# EasyEDA schematic schematic.json
TITLE: Sheet_1; REV: 3.1; Date: 2021-11-14; Sheet: 1/1; Drawn By: hktkzyx; Company: hktkzyx
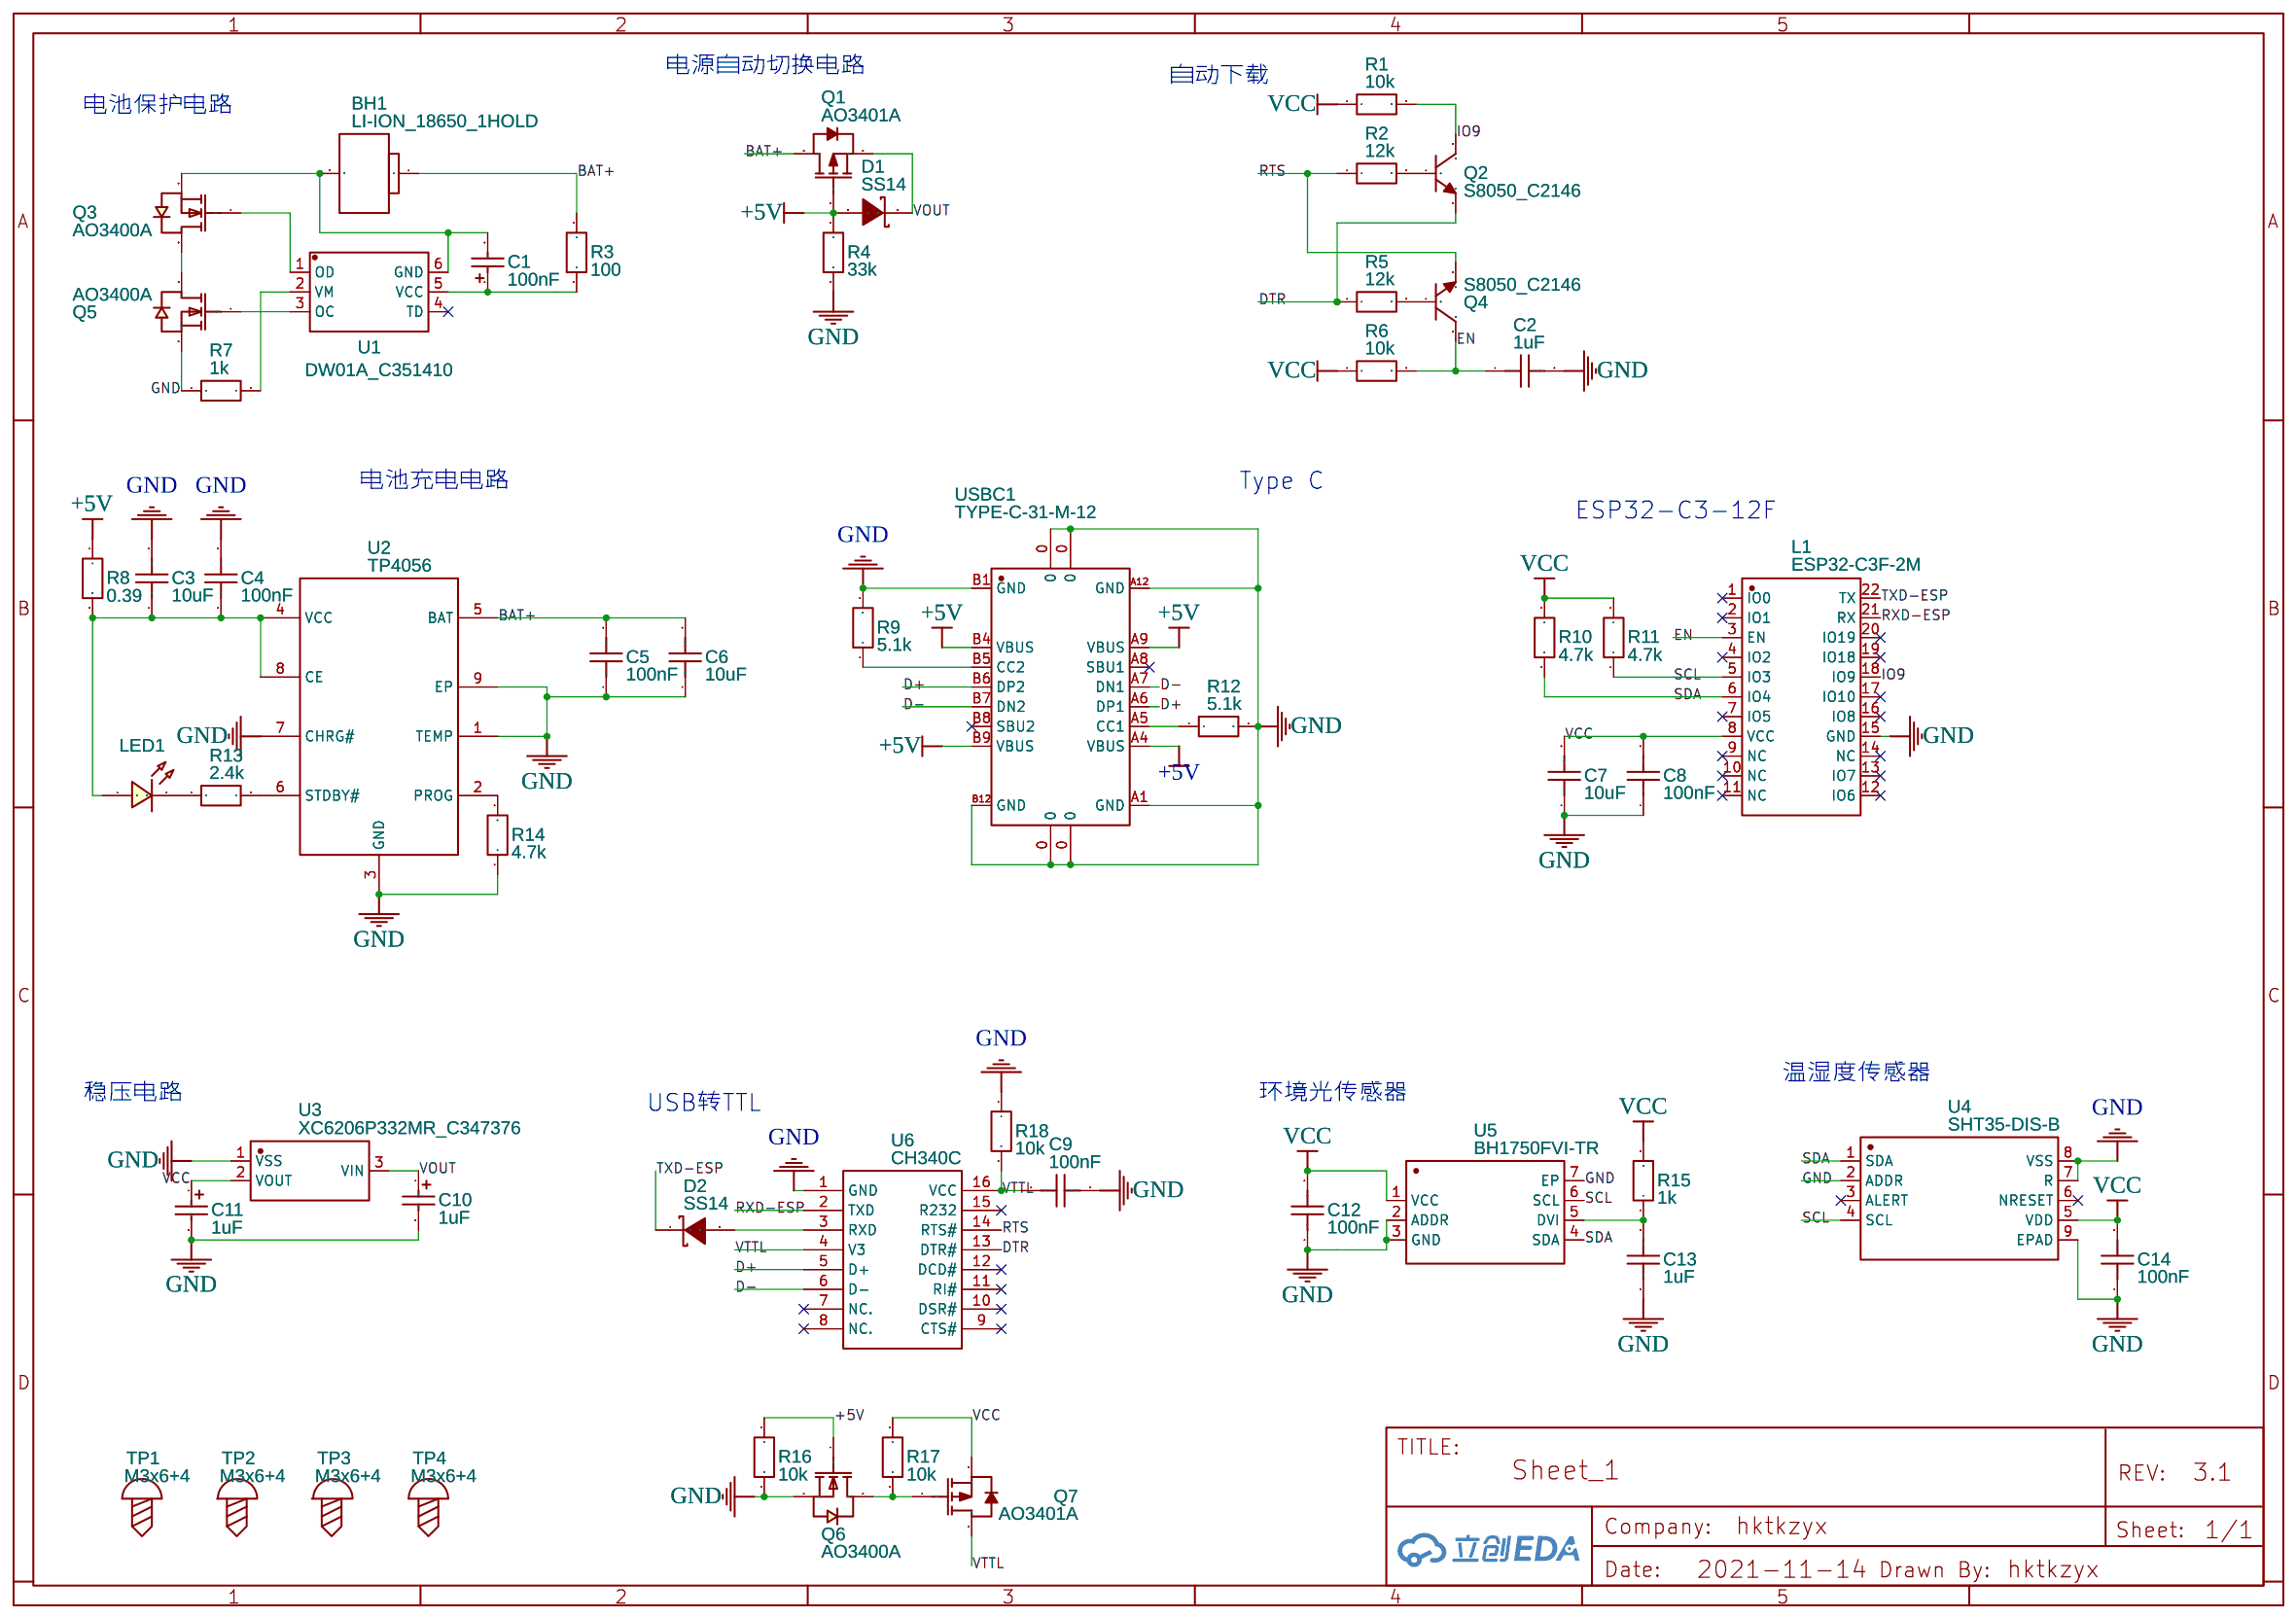
[diagram p0: schematic sheet]

## Parts
BH1  LI-ION_18650_1HOLD  [LI-ION_18650_1HOLD]
C1  100nF  [CAP-SMD_L3.2-W1.6]
C2  1uF  [C0603]
C3  10uF  [C0603]
C4  100nF  [C0603]
C5  100nF  [C0603]
C6  10uF  [C0603]
C7  10uF  [C0603]
C8  100nF  [C0603]
C9  100nF  [C0603]
C10  1uF  [CAP-SMD_L3.2-W1.6-R-RD]
C11  1uF  [CAP-SMD_L3.2-W1.6-R-RD]
C12  100nF  [C0603]
C13  1uF  [C0603]
C14  100nF  [C0603]
D1  SS14  [SMA_L4.4-W2.8-LS5.4-RD]
D2  SS14  [SMA_L4.4-W2.8-LS5.4-RD]
L1  ESP32-C3F-2M  [WIFIM-SMD_ESP32-C3F-2M]
LED1  LED-0603_G  [LED0603_GREEN]
Q1  AO3401A  [SOT-23_L2.9-W1.3-P1.90-LS2.4-BR]
Q2  S8050_C2146  [SOT-23-3_L3.0-W1.7-P0.95-LS2.9-BR]
Q3  AO3400A  [SOT-23-3_L2.9-W1.6-P1.90-LS2.8-BR]
Q4  S8050_C2146  [SOT-23-3_L3.0-W1.7-P0.95-LS2.9-BR]
Q5  AO3400A  [SOT-23-3_L2.9-W1.6-P1.90-LS2.8-BR]
Q6  AO3400A  [SOT-23-3_L2.9-W1.6-P1.90-LS2.8-BR]
Q7  AO3401A  [SOT-23_L2.9-W1.3-P1.90-LS2.4-BR]
R1  10k  [R0603]
R2  12k  [R0603]
R3  100  [R0603]
R4  33k  [R0603]
R5  12k  [R0603]
R6  10k  [R0603]
R7  1k  [R0603]
R8  0.39  [R2010]
R9  5.1k  [R0603]
R10  4.7k  [R0603]
R11  4.7k  [R0603]
R12  5.1k  [R0603]
R13  2.4k  [R0603]
R14  4.7k  [R0603]
R15  1k  [R0603]
R16  10k  [R0603]
R17  10k  [R0603]
R18  10k  [R0603]
TP1  M3x6+4  [M3铜柱]
TP2  M3x6+4  [M3铜柱]
TP3  M3x6+4  [M3铜柱]
TP4  M3x6+4  [M3铜柱]
U1  DW01A_C351410  [SOT-23-6_L2.9-W1.6-P0.95-LS2.8-BL]
U2  TP4056  [ESOP-8_L4.9-W3.9-P1.27-LS6.0-BL-EP]
U3  XC6206P332MR_C347376  [SOT-23-3_L3.0-W1.7-P0.95-LS2.9-BR]
U4  SHT35-DIS-B  [DFN-8_L2.5-W2.5-P0.50-TL-EP]
U5  BH1750FVI-TR  [WSOF-6_L2.6-W1.6-P0.50-TL-EP]
U6  CH340C  [SOP-16_L10.0-W3.9-P1.27-LS6.0-BL]
USBC1  TYPE-C-31-M-12  [USB-C_SMD-TYPE-C-31-M-12]

## Library data of the parts
BH1 = LI-ION_18650_1HOLD: Manufacturer: BLM; Manufacturer Part: BH18650-PC2; Supplier: 美泰森电子; link: https://item.taobao.com/item.htm?spm=a1z10.5-c.w4002-3096404056.37.79a853e9YJFuWN&id=537624028303; Contributor: LoveYan; 美岩编码: Q22001; 单价: 0.8
C1 = TAJA104K035RNJ: Supplier: LCSC; Manufacturer: AVX; Supplier Part: C7173; JLCPCB Part Class: Extended Part
C2 C13 = C_0603_US: Supplier Part: C15849; Supplier: LCSC; Contributor: LCEDA_Lib; Manufacturer Part: CL10A105KB8NNNC; Manufacturer: SAMSUNG
C3 C6 C7 = C_0603_US: Supplier Part: C19702; Supplier: LCSC; Contributor: LCEDA_Lib; Manufacturer Part: CL10A106KP8NNNC; Manufacturer: SAMSUNG
C4 C5 C8 C9 C12 C14 = C_0603_US: Supplier Part: C14663; Supplier: LCSC; Contributor: LCEDA_Lib; Manufacturer Part: CC0603KRX7R9BB104; Manufacturer: YAGEO
C10 C11 = TAJA105K016RNJ: Supplier: LCSC; Manufacturer: AVX; Supplier Part: C7174; JLCPCB Part Class: Extended Part
D1 D2 = SS14: Supplier: LCSC; Manufacturer: MDD; Supplier Part: C2480; JLCPCB Part Class: Basic Part
L1 = ESP32-C3F-2M: Supplier: LCSC; Supplier Part: C2830867; Manufacturer: Ai-Thinker(安信可); Contributor: LCSC; JLCPCB Part Class: Extended Part
LED1 = LED-0603_G: Manufacturer: EVERLIGHT(台湾亿光); Manufacturer Part: 19-217/GHC-YR1S2/3T; Supplier Part: C72043; Supplier: LCSC; Contributor: LCEDA_Lib
Q1 Q7 = AO3401A: Supplier: LCSC; Manufacturer: AOS; Supplier Part: C15127; JLCPCB Part Class: Basic Part
Q2 Q4 = S8050_C2146: Supplier: LCSC; Manufacturer: CJ; Manufacturer Part: S8050; Supplier Part: C2146; JLCPCB Part Class: Basic Part
Q3 Q5 Q6 = AO3400A: Supplier: LCSC; Manufacturer: AOS; Supplier Part: C20917; JLCPCB Part Class: Basic Part
R1 R6 R16-R18 = R_0603_EU: Supplier Part: C25804; Supplier: LCSC; Contributor: LCEDA_Lib; Manufacturer Part: 0603WAF1002T5E; Manufacturer: UniOhm
R2 R5 = R_0603_EU: Supplier Part: C22790; Supplier: LCSC; Contributor: LCEDA_Lib; Manufacturer Part: 0603WAF1202T5E; Manufacturer: UniOhm
R3 = R_0603_EU: Supplier Part: C22775; Supplier: LCSC; Contributor: LCEDA_Lib; Manufacturer Part: 0603WAF1000T5E; Manufacturer: UniOhm
R4 = R_0603_EU: Supplier Part: C4216; Supplier: LCSC; Contributor: LCEDA_Lib; Manufacturer Part: 0603WAF3302T5E; Manufacturer: UniOhm
R7 R15 = R_0603_EU: Supplier Part: C21190; Supplier: LCSC; Contributor: LCEDA_Lib; Manufacturer Part: 0603WAF1001T5E; Manufacturer: UniOhm
R8 = R_2010_EU: Supplier Part: C159205; Supplier: LCSC; Contributor: LCEDA_Lib; Manufacturer Part: RTT20R390FTE; Manufacturer: RALEC
R9 R12 = R_0603_EU: Supplier Part: C23186; Supplier: LCSC; Contributor: LCEDA_Lib; Manufacturer Part: 0603WAF5101T5E; Manufacturer: UniOhm
R10 R11 R14 = R_0603_EU: Supplier Part: C23162; Supplier: LCSC; Contributor: LCEDA_Lib; Manufacturer Part: 0603WAF4701T5E; Manufacturer: UniOhm
R13 = R_0603_EU: Supplier Part: C22940; Supplier: LCSC; Contributor: LCEDA_Lib; Manufacturer Part: 0603WAF2401T5E; Manufacturer: UniOhm
TP1-TP4 = M3x6+4: Supplier Part: C551320; Contributor: 立创EDA电子小制作
U1 = DW01A_C351410: Supplier: LCSC; Supplier Part: C351410; Manufacturer: PUOLOP; Manufacturer Part: DW01A; Contributor: LCSC; JLCPCB Part Class: Extended Part
U2 = TP4056: Contributor: Guest; Supplier: LCSC; Manufacturer: TOPPOWER; Supplier Part: C16581; JLCPCB Part Class: Basic Part
U3 = XC6206P332MR_C347376: Supplier: LCSC; Supplier Part: C347376; Manufacturer: Youtai Semiconductor Co., Ltd.; Manufacturer Part: XC6206P332MR; Contributor: LCSC; JLCPCB Part Class: Extended Part
U4 = SHT35-DIS-B: Supplier: LCSC; Supplier Part: C90161; Manufacturer: Sensirion; Contributor: LCSC; JLCPCB Part Class: Extended Part
U5 = BH1750FVI-TR: Supplier: LCSC; Manufacturer: ROHM; Supplier Part: C78960; JLCPCB Part Class: Extended Part
U6 = CH340C: Supplier: LCSC; Manufacturer: WCH; Supplier Part: C84681; JLCPCB Part Class: Extended Part
USBC1 = TYPE-C-31-M-12: Supplier: LCSC; Supplier Part: C165948; Manufacturer: Rectangular Connectors - Contacts; Contributor: LCSC; JLCPCB Part Class: Extended Part

## Nets
+5V: D1.2(A) Q1.1(G) Q6.1(G) R4.2 R8.1 R16.2 USBC1.A4(VBUS) USBC1.A9(VBUS) USBC1.B4(VBUS) USBC1.B9(VBUS)
GND: C2.2 C3.2 C4.2 C5.1 C6.1 C7.1 C8.1 C9.2 C10.2 C11.2 C12.1 C13.1 C14.1 L1.15(GND) Q5.2(S) Q6.2(S) R4.1 R7.1 R9.2 R12.2 R14.1 R16.1 R18.1 U2.1(TEMP) U2.3(GND) U2.7(CHRG#) U2.9(EP) U3.1(VSS) U4.2(ADDR) U4.7(R) U4.8(VSS) U4.9(EPAD) U5.2(ADDR) U5.3(GND) U5.7(EP) U6.1(GND) USBC1.0 USBC1.A1(GND) USBC1.A12(GND) USBC1.B1(GND) USBC1.B12(GND)
VCC: C7.2 C8.2 C11.1 C12.2 C14.2 L1.8(VCC) Q7.2(S) R1.1 R6.1 R10.2 R11.2 R15.2 R17.2 U3.2(VOUT) U4.5(VDD) U5.1(VCC)
BAT+: BH1.1 C5.2 C6.2 Q1.3(D) R3.2 U2.5(BAT)
D+: U6.5(D+) USBC1.A6(DP1) USBC1.B6(DP2)
D-: U6.6(D-) USBC1.A7(DN1) USBC1.B7(DN2)
DTR: Q2.2(E) R5.1 U6.13(DTR#)
EN: C2.1 L1.3(EN) Q4.3(C) R6.2
IO9: L1.18(IO9) Q2.3(C) R1.2
RTS: Q4.2(E) R2.1 U6.14(RTS#)
RXD-ESP: L1.21(RX) U6.2(TXD)
SCL: L1.5(IO3) R11.1 U4.4(SCL) U5.6(SCL)
SDA: L1.6(IO4) R10.1 U4.1(SDA) U5.4(SDA)
TXD-ESP: D2.1(K) L1.22(TX)
VOUT: C10.1 D1.1(K) Q1.2(S) U3.3(VIN)
VTTL: C9.1 Q7.3(D) R18.2 U6.4(V3) U6.16(VCC)
Net-(BH1-2): BH1.2 C1.2 Q3.2(S) U1.6(GND)
Net-(C1-1): C1.1 R3.1 U1.5(VCC)
Net-(C3-1): C3.1 C4.1 LED1.1 R8.2 U2.4(VCC) U2.8(CE)
Net-(C13-2): C13.2 R15.1 U5.5(DVI)
Net-(D2-2): D2.2(A) U6.3(RXD)
Net-(LED1-2): LED1.2 R13.1
Net-(Q2-1): Q2.1(B) R2.2
Net-(Q3-1): Q3.1(G) U1.1(OD)
Net-(Q3-3): Q3.3(D) Q5.3(D)
Net-(Q4-1): Q4.1(B) R5.2
Net-(Q5-1): Q5.1(G) U1.3(OC)
Net-(Q6-3): Q6.3(D) Q7.1(G) R17.1
Net-(R7-2): R7.2 U1.2(VM)
Net-(R9-1): R9.1 USBC1.B5(CC2)
Net-(R12-1): R12.1 USBC1.A5(CC1)
Net-(R13-2): R13.2 U2.6(STDBY#)
Net-(R14-2): R14.2 U2.2(PROG)

Not connected (* = marked no-connect by the designer): L1 1(IO0)* 2(IO1)* 4(IO2)* 7(IO5)* 9(NC)* 10(NC)* 11(NC)* 12(IO6)* 13(IO7)* 14(NC)* 16(IO8)* 17(IO10)* 19(IO18)* 20(IO19)*; U1 4(TD)*; U4 3(ALERT)* 6(NRESET)*; U6 7(NC.)* 8(NC.)* 9(CTS#)* 10(DSR#)* 11(RI#)* 12(DCD#)* 15(R232)*; USBC1 A8(SBU1)* B8(SBU2)*

## Notes on the sheet
- 电源自动切换电路
- 自动下载
- 电池保护电路
- 电池充电电路
- Type C
- ESP32-C3-12F
- 温湿度传感器
- 稳压电路
- USB转TTL
- 环境光传感器
